# EAGLE design Shield (EAGLE 6.6.0)
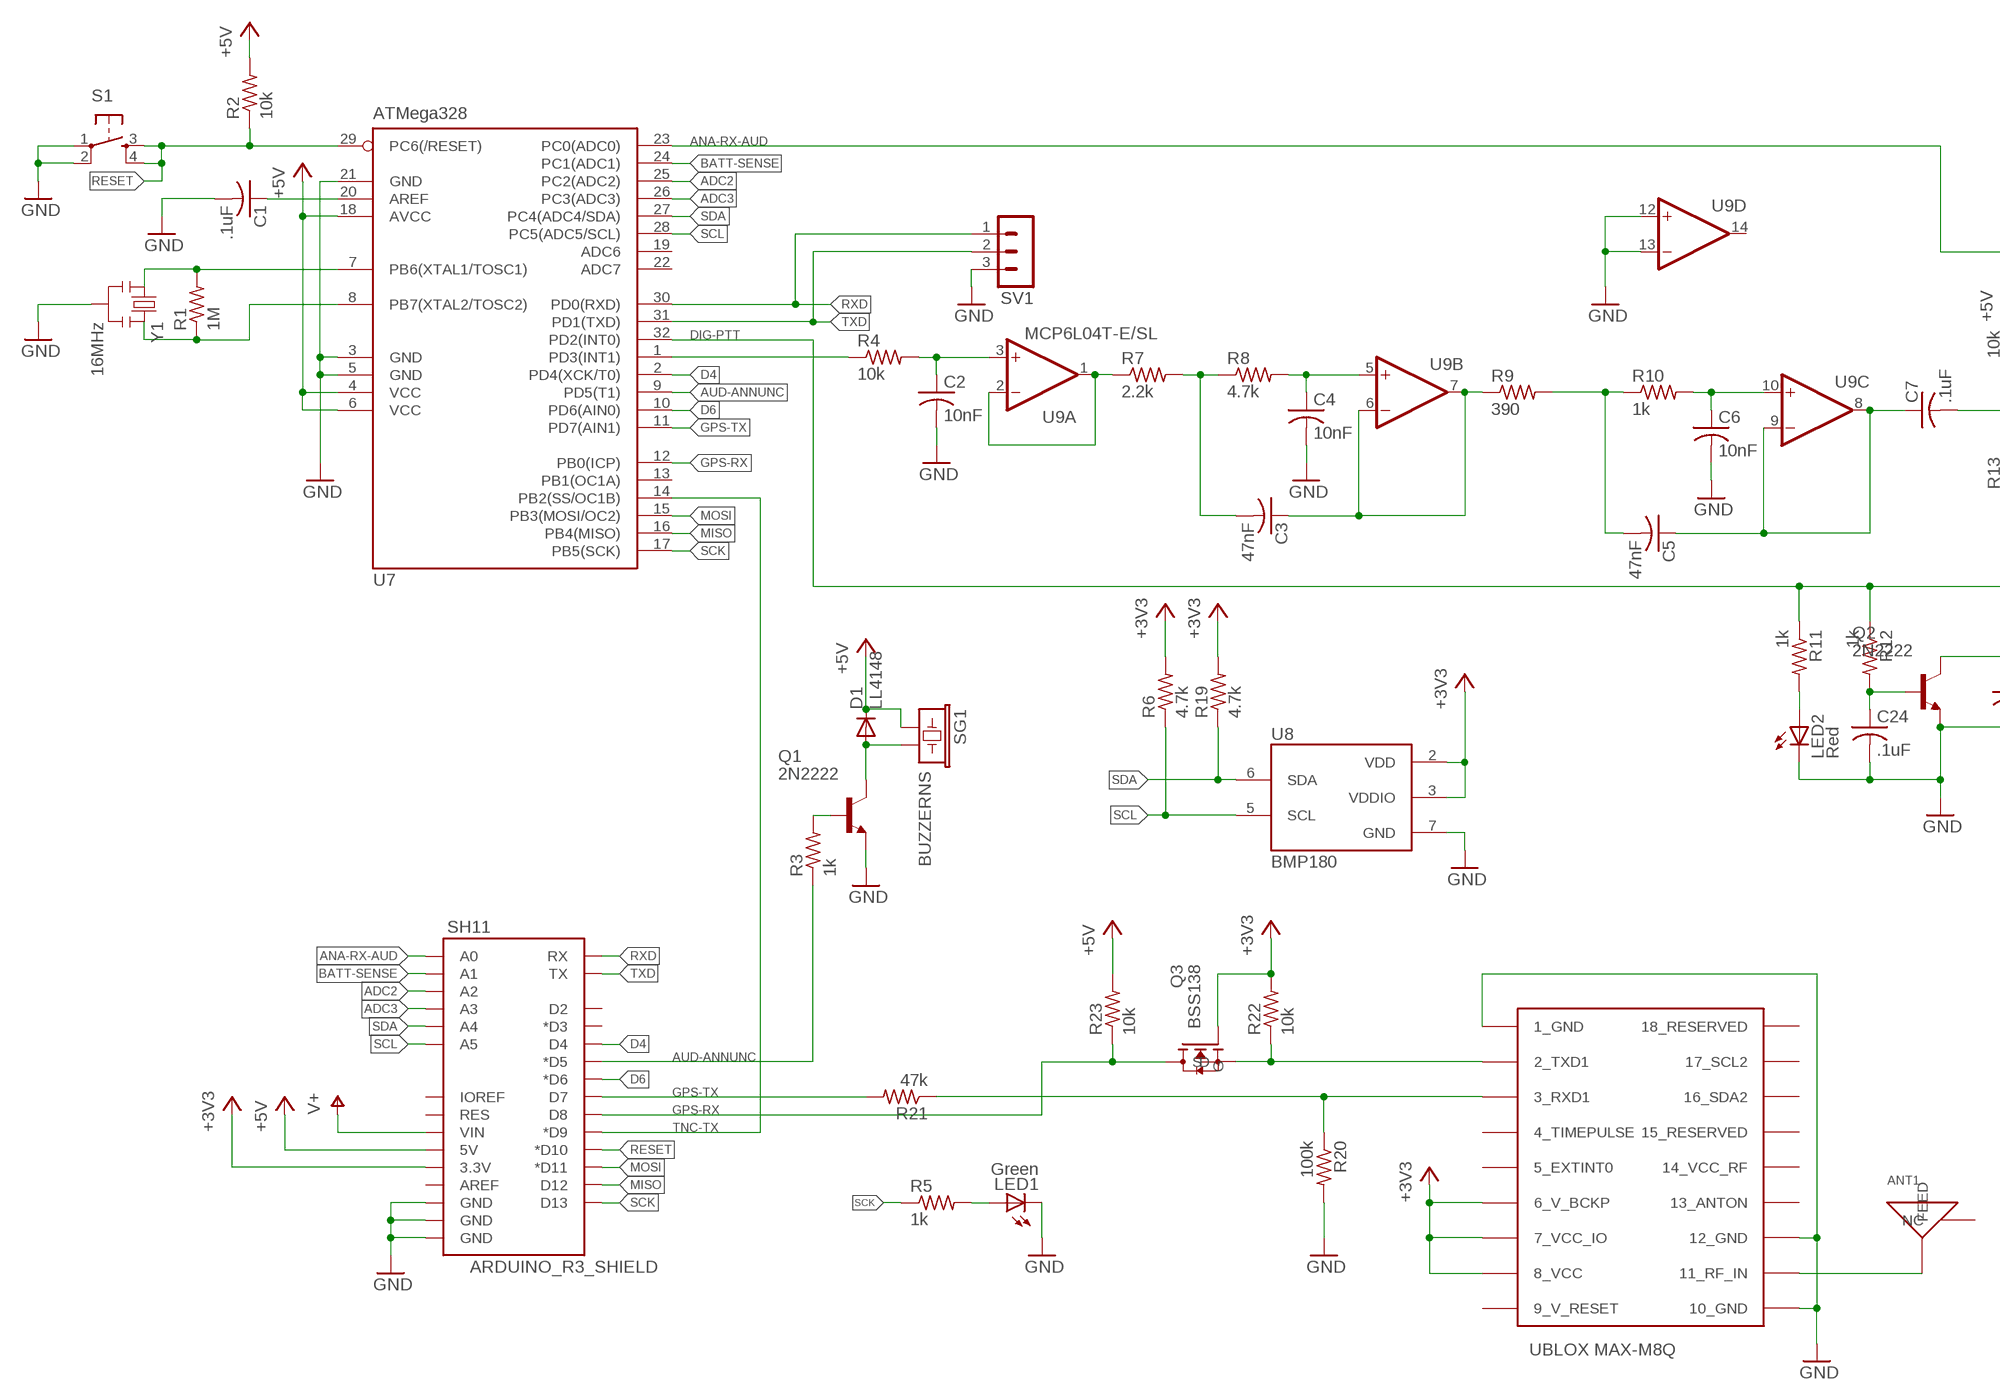
[diagram p0: schematic, sheet 1, part 1 of 2]
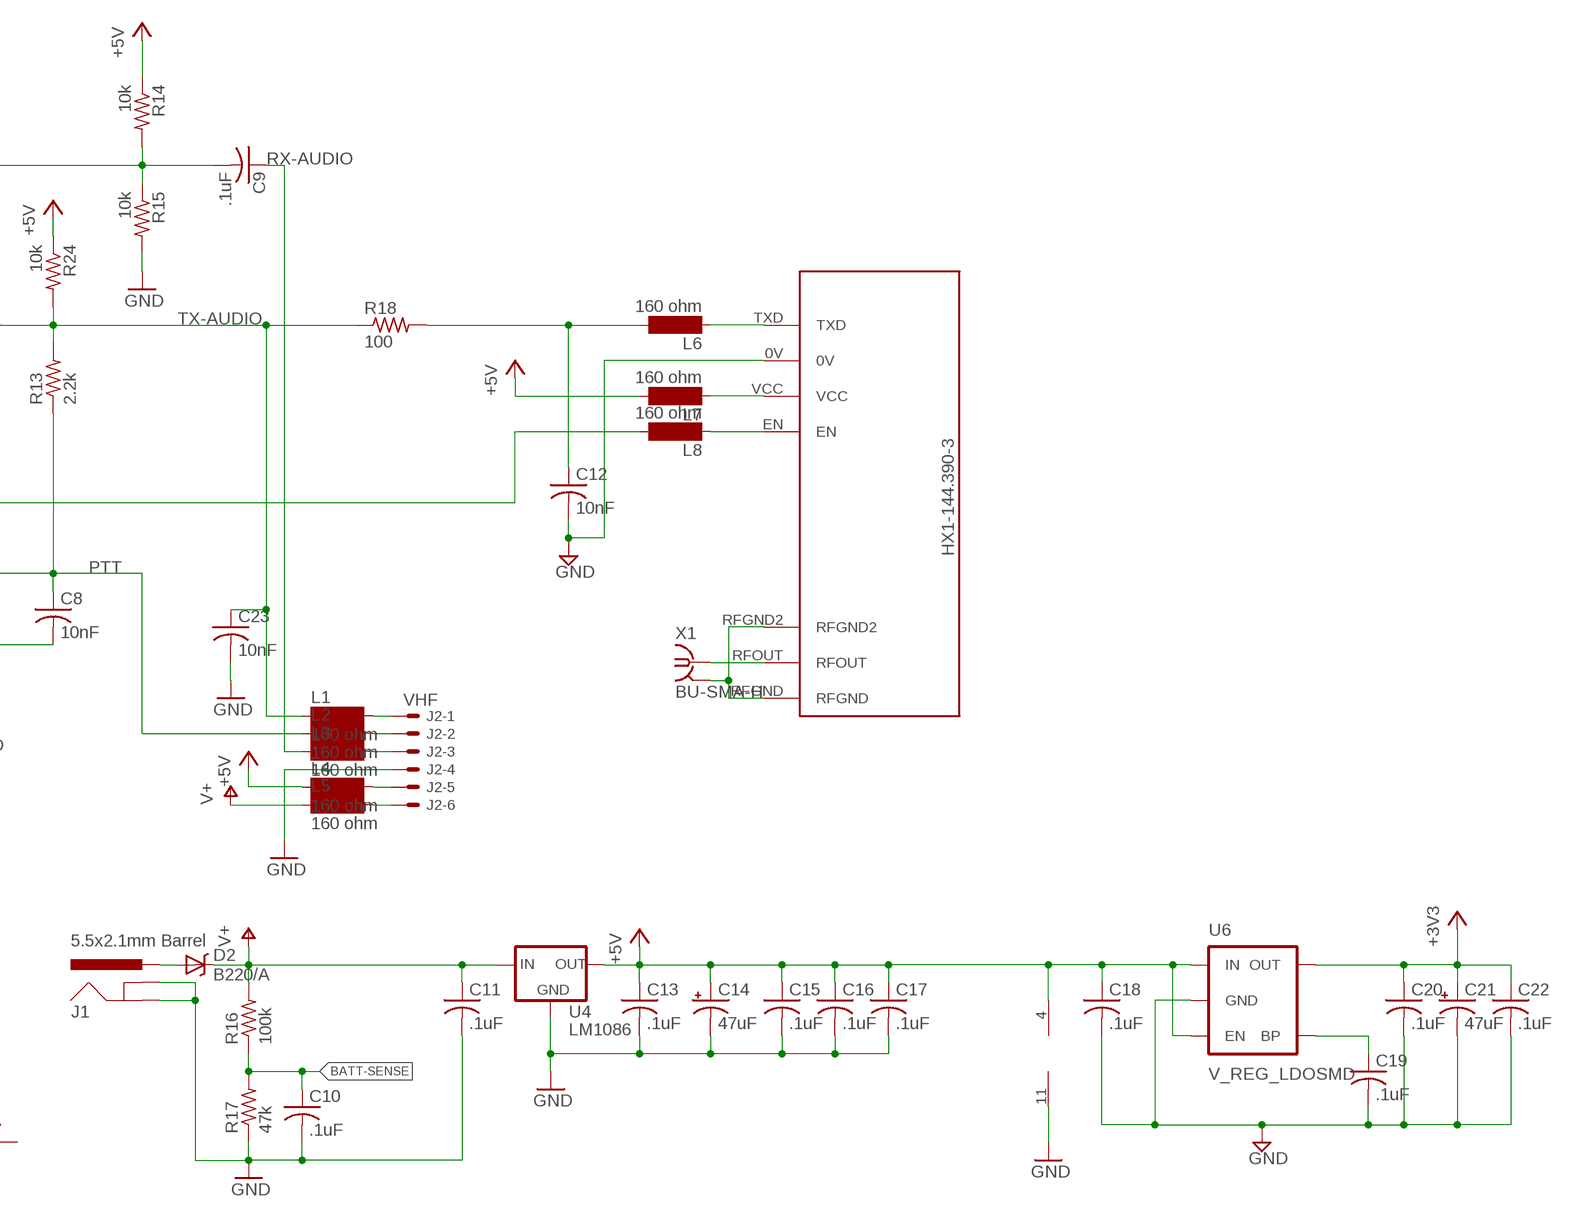
[diagram p1: schematic, sheet 1, part 2 of 2]

## Parts
ANT1  GPS_ANT_SMDBAR  [1575AT43A40]
C1  .1uF  C-USC0805  [C0805]
C2  10nF  C-USC0805  [C0805]
C3  47nF  C-USC0805  [C0805]
C4  10nF  C-USC0805  [C0805]
C5  47nF  C-USC0805  [C0805]
C6  10nF  C-USC0805  [C0805]
C7  .1uF  C-USC0805  [C0805]
C8  10nF  C-USC0805  [C0805]
C9  .1uF  C-USC0805  [C0805]
C10  .1uF  C-USC0805  [C0805]
C11  .1uF  C-USC0805  [C0805]
C12  10nF  C-USC0805  [C0805]
C13  .1uF  C-USC0805  [C0805]
C14  47uF  CPOL-US153CLV-0605  [153CLV-0605]
C15  .1uF  C-USC0805  [C0805]
C16  .1uF  C-USC0805  [C0805]
C17  .1uF  C-USC0805  [C0805]
C18  .1uF  C-USC0805  [C0805]
C19  .1uF  C-USC0805  [C0805]
C20  .1uF  C-USC0805  [C0805]
C21  47uF  CPOL-US153CLV-0605  [153CLV-0605]
C22  .1uF  C-USC0805  [C0805]
C23  10nF  C-USC0805  [C0805]
C24  .1uF  C-USC0805  [C0805]
D1  LL4148  DIODE-MINIMELF  [MINIMELF]
D2  B220/A  B340A  [SMA-DIODE]
J1  5.5x2.1mm Barrel  POWER_JACKSMD  [POWER_JACK_SMD]
J2  VHF  22-05-7068-06  [7395-06]
L1  160 ohm  SM-1206  [SM-1206]
L2  160 ohm  SM-1206  [SM-1206]
L3  160 ohm  SM-1206  [SM-1206]
L4  160 ohm  SM-1206  [SM-1206]
L5  160 ohm  SM-1206  [SM-1206]
L6  160 ohm  SM-1206  [SM-1206]
L7  160 ohm  SM-1206  [SM-1206]
L8  160 ohm  SM-1206  [SM-1206]
LED1  Green  LEDCHIPLED_1206  [CHIPLED_1206]
LED2  Red  LEDCHIPLED_1206  [CHIPLED_1206]
Q1  2N2222  BC817-16LT1SMD  [SOT23-BEC]
Q2  2N2222  BC817-16LT1SMD  [SOT23-BEC]
Q3  BSS138  [BSS138]
R1  1M  R-US_R0805  [R0805]
R2  10k  R-US_R0805  [R0805]
R3  1k  R-US_R0805  [R0805]
R4  10k  R-US_R0805  [R0805]
R5  1k  R-US_R0805  [R0805]
R6  4.7k  R-US_R0805  [R0805]
R7  2.2k  R-US_R0805  [R0805]
R8  4.7k  R-US_R0805  [R0805]
R9  390  R-US_R0805  [R0805]
R10  1k  R-US_R0805  [R0805]
R11  1k  R-US_R0805  [R0805]
R12  1k  R-US_R0805  [R0805]
R13  2.2k  R-US_R0805  [R0805]
R14  10k  R-US_R0805  [R0805]
R15  10k  R-US_R0805  [R0805]
R16  100k  R-US_R0805  [R0805]
R17  47k  R-US_R0805  [R0805]
R18  100  R-US_R0805  [R0805]
R19  4.7k  R-US_R0805  [R0805]
R20  100k  R-US_R0805  [R0805]
R21  47k  R-US_R0805  [R0805]
R22  10k  R-US_R0805  [R0805]
R23  10k  R-US_R0805  [R0805]
R24  10k  R-US_R0805  [R0805]
S1  TAC_SWITCHSMD  [TACTILE_SWITCH_SMD]
SG1  BUZZERNS  [BUZZER-12MM-NS]
SH11  ARDUINO_R3_SHIELD  [UNO_R3_SHIELD]
SV1  MA03-1  [MA03-1]
U3  UBLOX_MAX  [UBLOX_MAX]
U4  LM1086  LM1086TO263  [TO263]
U5  RADIOMETRIX-HX1  [RADIOMETRIX-HX1]
U6  V_REG_LDOSMD  [SOT23-5]
U7  ATMega328  MEGA8-AI  [TQFP32-08]
U8  BMP180  [BMP180]
U9  LMV324M  [SO14]
X1  BU-SMA-H  [BU-SMA-H]
Y1  16MHz  RESONATOR16MHZ  [RESONATOR-SMD]

## Nets
+3V3: C20.1 C21.+ C22.1 Q3.G R6.2 R19.2 R22.2 SH11.3.3V U3.6_V_BCKP U3.7_VCC_IO U3.8_VCC U6.5(OUT) U8.2(VDD) U8.3(VDDIO)
+5V [Power]: C13.1 C14.+ C15.1 C16.1 C17.1 C18.1 D1.C L4.1 L7.2 R2.2 R14.1 R23.2 R24.1 SG1.+ SH11.5V U4.2(OUT) U6.1(IN) U6.3(EN) U7.4(VCC) U7.6(VCC) U7.18(AVCC) U9.4(P:V+)
ADC2: SH11.A2 U7.25(PC2(ADC2))
ADC3: SH11.A3 U7.26(PC3(ADC3))
ANA-RX-AUD: C9.2 R14.2 R15.1 SH11.A0 U7.23(PC0(ADC0))
AUD-ANNUNC: R3.1 SH11.D5(*D5) U7.9(PD5(T1))
BATT-SENSE: C10.1 R16.1 R17.2 SH11.A1 U7.24(PC1(ADC1))
D4: SH11.D4 U7.2(PD4(XCK/T0))
D6: SH11.D6(*D6) U7.10(PD6(AIN0))
DIG-PTT: L8.2 R11.1 R12.1 U7.32(PD2(INT0))
GND [Power]: C1.2 C2.2 C4.2 C6.2 C8.2 C10.2 C11.2 C12.2 C13.2 C14.- C15.2 C16.2 C17.2 C18.2 C19.2 C20.2 C21.- C22.2 C23.2 C24.2 J1.GND(GNDBREAK) J1.P$4(GND) J2.4 LED1.C LED2.C Q1.E Q2.E R15.2 R17.1 R20.2 S1.1 S1.2 SH11.GND@0(GND) SH11.GND@1(GND) SH11.GND@2(GND) SV1.3 U3.1_GND U3.10_GND U3.12_GND U4.1(GND) U5.0V U6.2(GND) U7.3(GND) U7.5(GND) U7.21(GND) U8.7(GND) U9.11(P:V-) U9.12(D:+IN) U9.13(D:-IN) Y1.2
GPS-RX: Q3.D R23.1 SH11.D8 U7.12(PB0(ICP))
GPS-TX: R21.2 SH11.D7 U7.11(PD7(AIN1))
MISO: SH11.D12 U7.16(PB4(MISO))
MOSI: SH11.D11(*D11) U7.15(PB3(MOSI/OC2))
N$1: C2.1 R4.2 U9.3(A:+IN)
N$2: R7.1 U9.1(A:OUT) U9.2(A:-IN)
N$3: C3.2 R7.2 R8.1
N$4: C4.1 R8.2 U9.5(B:+IN)
N$5: C3.1 R9.1 U9.6(B:-IN) U9.7(B:OUT)
N$6: C5.2 R9.2 R10.1
N$7: C6.1 R10.2 U9.10(C:+IN)
N$8: D2.A J1.VIN0(PWR)
N$9: D1.A Q1.C SG1.-
N$10: C12.1 L6.2 R18.2
N$11: C5.1 C7.1 U9.8(C:OUT) U9.9(C:-IN)
N$12: U5.RFOUT X1.1
N$13: R4.1 U7.1(PD3(INT1))
N$14: Q3.S R22.1 U3.2_TXD1
N$15: R20.1 R21.1 U3.3_RXD1
N$16: ANT1.FEED U3.11_RF_IN
N$17: R1.1 U7.8(PB7(XTAL2/TOSC2)) Y1.3
N$20: C24.1 Q2.B R12.2
N$23: LED2.A R11.2
N$25: LED1.A R5.2
N$27: Q1.B R3.2
N$41: L6.1 U5.TXD
N$42: L7.1 U5.VCC
N$43: L8.1 U5.EN
N$45: J2.1 L1.2
N$46: J2.2 L2.2
N$47: J2.3 L3.2
N$49: J2.5 L4.2
N$50: J2.6 L5.2
N$59: C1.1 U7.20(AREF)
N$60: C19.1 U6.4(BP)
N$64: R1.2 U7.7(PB6(XTAL1/TOSC1)) Y1.1
PTT: C8.1 L2.1 Q2.C R13.1
RESET: R2.1 S1.3 S1.4 SH11.D10(*D10) U7.29(PC6(/RESET))
RFGND [Power]: U5.RFGND U5.RFGND2 X1.2 X1.3 X1.4 X1.5
RX-AUDIO: C9.1 L3.1
RXD: SH11.RX SV1.1 U7.30(PD0(RXD))
SCK: R5.1 SH11.D13 U7.17(PB5(SCK))
SCL: R6.1 SH11.A5 U7.28(PC5(ADC5/SCL)) U8.5(SCL)
SDA: R19.1 SH11.A4 U7.27(PC4(ADC4/SDA)) U8.6(SDA)
TNC-TX: SH11.D9(*D9) U7.14(PB2(SS/OC1B))
TX-AUDIO: C7.2 C23.1 L1.1 R13.2 R18.1 R24.2
TXD: SH11.TX SV1.2 U7.31(PD1(TXD))
V+ [Power]: C11.1 D2.C L5.1 R16.2 SH11.VIN U4.3(IN)
Unconnected: ANT1.NC SH11.AREF SH11.D2 SH11.D3(*D3) SH11.IOREF SH11.RES U3.4_TIMEPULSE U3.5_EXTINT0 U3.13_ANTON U3.14_VCC_RF U3.15_RESERVED U3.16_SDA2 U3.17_SCL2 U3.18_RESERVED U7.13(PB1(OC1A)) U7.19(ADC6) U7.22(ADC7) U9.14(D:OUT)

## Power pins joined to a net without a drawn wire
9_V_RESET: U3.9_V_RESET

## Library data of the parts
ANT1 = Parts:GPS_ANT_SMDBAR: 1.575 GHz GPS Antenna Johanson Technology http://www.digikey.com/product-detail/en/1575AT43A0040E/712-1003-1-ND/1560832; DIGIKEY: 712-1003-1-ND
C1 C7 C9-C11 C13 C15-C20 C22 C24 = resistor:C-US: CAPACITOR, American symbol; DIGIKEY: 311-1361-1-ND
C2 C4 C6 C8 C12 C23 = resistor:C-US: CAPACITOR, American symbol; DIGIKEY: 399-1158-1-ND
C3 C5 = resistor:C-US: CAPACITOR, American symbol; DIGIKEY: 399-1166-1-ND
C14 C21 = resistor:CPOL-US: POLARIZED CAPACITOR, American symbol; DIGIKEY: PCE3842CT-ND
D1 = diode:DIODE-: DIODE; DIGIKEY: 568-1749-1-ND
D2 = SparkFun-DiscreteSemi:B340A: Schottky Diode 3A-40V; DIGIKEY: 641-1258-1-ND; PROD_ID: DIO-09886; VALUE: BA340A
J1 = SparkFun-Connectors:POWER_JACK: Power Jack This is the standard 5.5mm barrel jack for power. The PTH is the most common, proven, reliable, footprint. The Slot footprint only works if the mill layer is transmitted to the PCB fab house so be warned. Mating wall wart : TOL-00298 (and others); DIGIKEY: CP-002AHPJCT-ND; PROD_ID: CONN-08106
J2 = con-molex:22-?-06: CONNECTOR wire to board 2.54 mm (.1 inch) pitch header; DIGIKEY: WM4304-ND; OC_FARNELL: unknown; OC_NEWARK: unknown
L1-L8 = inductor-neosid:SM-1206: INDUCTOR SMD chip inductor; DIGIKEY: 240-2411-1-ND; OC_FARNELL: unknown; OC_NEWARK: unknown
LED1 = led:LED: LED OSRAM: - CHIPLED LG R971, LG N971, LY N971, LG Q971, LY Q971, LO R971, LY R971 LH N974, LH R974 LS Q976, LO Q976, LY Q976 LO Q996 - Hyper CHIPLED LW Q18S LB Q993, LB Q99A, LB R99A - SideLED LS A670, LO A670, LY A670, LG A670, LP A670 LB A673, LV A673, LT A673, LW A673 LH A674 LY A675 LS A676, LA A676, LO A676, LY A676, LW A676 LS A679, LY A679, LG A679 - Hyper Micro SIDELED® LS Y876, LA Y876, LO Y876, LY Y876 LT Y87S - SmartLED LW L88C, LW L88S LB L89C, LB L89S, LG L890 LS L89K, LO L89K, LY L89K LS L896, LA L896, LO L896, LY L896 - TOPLED LS T670, LO T670, LY T670, LG T670, LP T670 LSG T670, LSP T670, LSY T670, LOP T670, LYG T670 LG T671, LOG T671, LSG T671 LB T673, LV T673, LT T673, LW T673 LH T674 LS T676, LA T676, LO T676, LY T676, LB T676, LH T676, LSB T676, LW T676 LB T67C, LV T67C, LT T67C, LS T67K, LO T67K, LY T67K, LW E67C LS E67B, LA E67B, LO E67B, LY E67B, LB E67C, LV E67C, LT E67C LW T67C LS T679, LY T679, LG T679 LS T770, LO T770, LY T770, LG T770, LP T770 LB T773, LV T773, LT T773, LW T773 LH T774 LS E675, LA E675, LY E675, LS T675 LS T776, LA T776, LO T776, LY T776, LB T776 LHGB T686 LT T68C, LB T68C - Hyper Mini TOPLED® LB M676 - Mini TOPLED Santana® LG M470 LS M47K, LO M47K, LY M47K Source: http://www.osram.convergy.de LUXEON: - LUMILED® LXK2-PW12-R00, LXK2-PW12-S00, LXK2-PW14-U00, LXK2-PW14-V00 LXK2-PM12-R00, LXK2-PM12-S00, LXK2-PM14-U00 LXK2-PE12-Q00, LXK2-PE12-R00, LXK2-PE12-S00, LXK2-PE14-T00, LXK2-PE14-U00 LXK2-PB12-K00, LXK2-PB12-L00, LXK2-PB12-M00, LXK2-PB14-N00, LXK2-PB14-P00, LXK2-PB14-Q00 LXK2-PR12-L00, LXK2-PR12-M00, LXK2-PR14-Q00, LXK2-PR14-R00 LXK2-PD12-Q00, LXK2-PD12-R00, LXK2-PD12-S00 LXK2-PH12-R00, LXK2-PH12-S00 LXK2-PL12-P00, LXK2-PL12-Q00, LXK2-PL12-R00 Source: www.luxeon.com KINGBRIGHT: KA-3528ASYC Source: www.kingbright.com; DIGIKEY: 160-1169-1-ND
LED2 = led:LED: LED OSRAM: - CHIPLED LG R971, LG N971, LY N971, LG Q971, LY Q971, LO R971, LY R971 LH N974, LH R974 LS Q976, LO Q976, LY Q976 LO Q996 - Hyper CHIPLED LW Q18S LB Q993, LB Q99A, LB R99A - SideLED LS A670, LO A670, LY A670, LG A670, LP A670 LB A673, LV A673, LT A673, LW A673 LH A674 LY A675 LS A676, LA A676, LO A676, LY A676, LW A676 LS A679, LY A679, LG A679 - Hyper Micro SIDELED® LS Y876, LA Y876, LO Y876, LY Y876 LT Y87S - SmartLED LW L88C, LW L88S LB L89C, LB L89S, LG L890 LS L89K, LO L89K, LY L89K LS L896, LA L896, LO L896, LY L896 - TOPLED LS T670, LO T670, LY T670, LG T670, LP T670 LSG T670, LSP T670, LSY T670, LOP T670, LYG T670 LG T671, LOG T671, LSG T671 LB T673, LV T673, LT T673, LW T673 LH T674 LS T676, LA T676, LO T676, LY T676, LB T676, LH T676, LSB T676, LW T676 LB T67C, LV T67C, LT T67C, LS T67K, LO T67K, LY T67K, LW E67C LS E67B, LA E67B, LO E67B, LY E67B, LB E67C, LV E67C, LT E67C LW T67C LS T679, LY T679, LG T679 LS T770, LO T770, LY T770, LG T770, LP T770 LB T773, LV T773, LT T773, LW T773 LH T774 LS E675, LA E675, LY E675, LS T675 LS T776, LA T776, LO T776, LY T776, LB T776 LHGB T686 LT T68C, LB T68C - Hyper Mini TOPLED® LB M676 - Mini TOPLED Santana® LG M470 LS M47K, LO M47K, LY M47K Source: http://www.osram.convergy.de LUXEON: - LUMILED® LXK2-PW12-R00, LXK2-PW12-S00, LXK2-PW14-U00, LXK2-PW14-V00 LXK2-PM12-R00, LXK2-PM12-S00, LXK2-PM14-U00 LXK2-PE12-Q00, LXK2-PE12-R00, LXK2-PE12-S00, LXK2-PE14-T00, LXK2-PE14-U00 LXK2-PB12-K00, LXK2-PB12-L00, LXK2-PB12-M00, LXK2-PB14-N00, LXK2-PB14-P00, LXK2-PB14-Q00 LXK2-PR12-L00, LXK2-PR12-M00, LXK2-PR14-Q00, LXK2-PR14-R00 LXK2-PD12-Q00, LXK2-PD12-R00, LXK2-PD12-S00 LXK2-PH12-R00, LXK2-PH12-S00 LXK2-PL12-P00, LXK2-PL12-Q00, LXK2-PL12-R00 Source: www.luxeon.com KINGBRIGHT: KA-3528ASYC Source: www.kingbright.com; DIGIKEY: 160-1405-1-ND
Q1 Q2 = transistor-npn:BC817*: NPN Transistor; DIGIKEY: MMBT2222AFSCT-ND
Q3 = Ava:BSS138: BSS138 N-Channel Logic Level Enhancement Mode Field Effect Transistor; DIGIKEY: BSS138CT-ND
R1 = resistor:R-US_: RESISTOR, American symbol; DIGIKEY: 311-1.0MARCT-ND
R2 R4 R14 R15 R22-R24 = resistor:R-US_: RESISTOR, American symbol; DIGIKEY: 311-10.0KCRCT-ND
R3 R5 R10-R12 = resistor:R-US_: RESISTOR, American symbol; DIGIKEY: 311-1.0KARCT-ND
R6 R8 R19 = resistor:R-US_: RESISTOR, American symbol; DIGIKEY: 311-4.7KARCT-ND
R7 R13 = resistor:R-US_: RESISTOR, American symbol; DIGIKEY: 311-2.2KARCT-ND
R9 = resistor:R-US_: RESISTOR, American symbol; DIGIKEY: 311-390ARCT-ND
R16 R20 = resistor:R-US_: RESISTOR, American symbol; DIGIKEY: 311-100KCRCT-ND
R17 R21 = resistor:R-US_: RESISTOR, American symbol; DIGIKEY: 311-47.0KCRCT-ND
R18 = resistor:R-US_: RESISTOR, American symbol; DIGIKEY: 311-100ARCT-ND
S1 = SparkFun-Electromechanical:TAC_SWITCH: Momentary Switch Button commonly used for reset or general input. Spark Fun Electronics SKU : COM-00097 SMT- SWCH-08247; DIGIKEY: CKN9104CT-ND; PROD_ID: SWCH-08247
SG1 = SparkFun-Electromechanical:BUZZER: Buzzer 12mm Spark Fun Electronics SKU : Comp-Buzzer; DIGIKEY: 102-1155-ND
SH11 = sparkfun-boards:ARDUINO_R3_SHIELD: Shield form compatible with the Arduino Uno R3.; SPARKFUN: PRT-10007
SV1 = con-lstb:MA03-1: PIN HEADER; DIGIKEY: 952-2264-ND; OC_FARNELL: unknown; OC_NEWARK: unknown
U3 = Ava:UBLOX_MAX: UBLOX MAX; ALT-PART: UBLOX MAX-M8Q
U4 = v-reg-2:LM1086; DIGIKEY: LM1086ISX-5.0/NOPBCT-ND
U5 = Ava:RADIOMETRIX-HX1; ALT-PART: HX1-144.390-3
U6 = SparkFun-PowerIC:V_REG_LDO: Voltage Regulator LDO Standard 150mA LDO voltage regulator in SOT-23 layout. Micrel part MIC5205. BP (by-pass) pin is used to lower output noise with 470pF cap.; DIGIKEY: LP3985IM5-3.3/NOPBCT-ND
U7 = atmel:MEGA8: MICROCONTROLLER 8 Kbytes FLASH, 1 kbytes SRAM, 512 bytes EEPROM, USART, 6-channel 10 bit ADC, 2-channel 8 bit ADC Pin compatible with Atmega48, ATMega88, ATMega168 Source: avr.lbr; DIGIKEY: ATMEGA328P-15AZCT-ND; MPN: ATMEGA8-16AU; OC_FARNELL: 9171371; OC_NEWARK: 73M8863
U8 = SparkFun-Sensors:BMP180: BOSCH BMP180 DIGITAL BAROMETRIC PRESSURE SENSOR Web page: http://www.bosch-sensortec.com/en/homepage/products_3/environmental_sensors_1/bmp180_1/bmp180 Datasheet: http://ae-bst.resource.bosch.com/media/products/dokumente/bmp180/BST-BMP180-DS000-09.pdf The BMP180 is the function compatible successor of the BMP085, a new generation of high precision digital pressure sensors for consumer applications. The ultra-low power, low voltage electronics of the BMP180 is optimized for use in mobile phones, PDAs, GPS navigation devices and outdoor equipment. With a low altitude noise of merely 0.25m at fast conversion time, the BMP180 offers superior performance. The I2C interface allows for easy system integration with a microcontroller. The BMP180 is based on piezo-resistive technology for EMC robustness, high accuracy and linearity as well as long term stability. Key features: - Temperature measurement included - I2C interface - Fully calibrated - Pb-free, halogen-free and RoHS compliant, - MSL 1 Basic specs: Pressure range: 300 to 1100hPa (+9000m to -500m relating to sea level) Supply voltage: 1.8 to 3.6V (VDD), 1.62V to 3.6V (VDDIO) Package: LGA package with metal lid Small footprint: 3.6mm x 3.8mm Super-flat: 0.93mm height Low power: 5μA at 1 sample / sec. in standard mode Low noise: 0.06hPa (0.5m) in ultra low power mode, 0.02hPa (0.17m) advanced resolution mode Typical applications: - Enhancement of GPS navigation (dead-reckoning, slope detection, etc.) - In- and out-door navigation - Leisure and sports - Weather forecast - Vertical velocity indication (rise/sink speed); SPARKFUN: COM-11823
U9 = linear:LMV324?*: Quad General Purpose, Low Voltage, Rail-to-Rail Output Operational Amplifiers Source: http://www.national.com/mpf/LM/LMV321.html http://www.national.com/dt/lmv_qual.pdf; ALT-PART: MCP6L04T-E/SL; DIGIKEY: MCP6L04T-E/SLCT-ND
X1 = con-coax:BU-SMA-H: FEMALE SMA CONNECTOR Radiall; DIGIKEY: CONSMA001-ND; OC_FARNELL: unknown; OC_NEWARK: unknown
Y1 = SparkFun-FreqCtrl:RESONATOR: Resonator Small SMD resonator. Used, eg, on the Arduino Pro/ Pro Mini boards. 8MHz- XTAL-08895 16MHz- XTAL-08900; DIGIKEY: 478-5420-1-ND; PROD_ID: XTAL-08900

## Net classes
1 Power: width 0.127 mm, clearance 0.025 mm

## Board
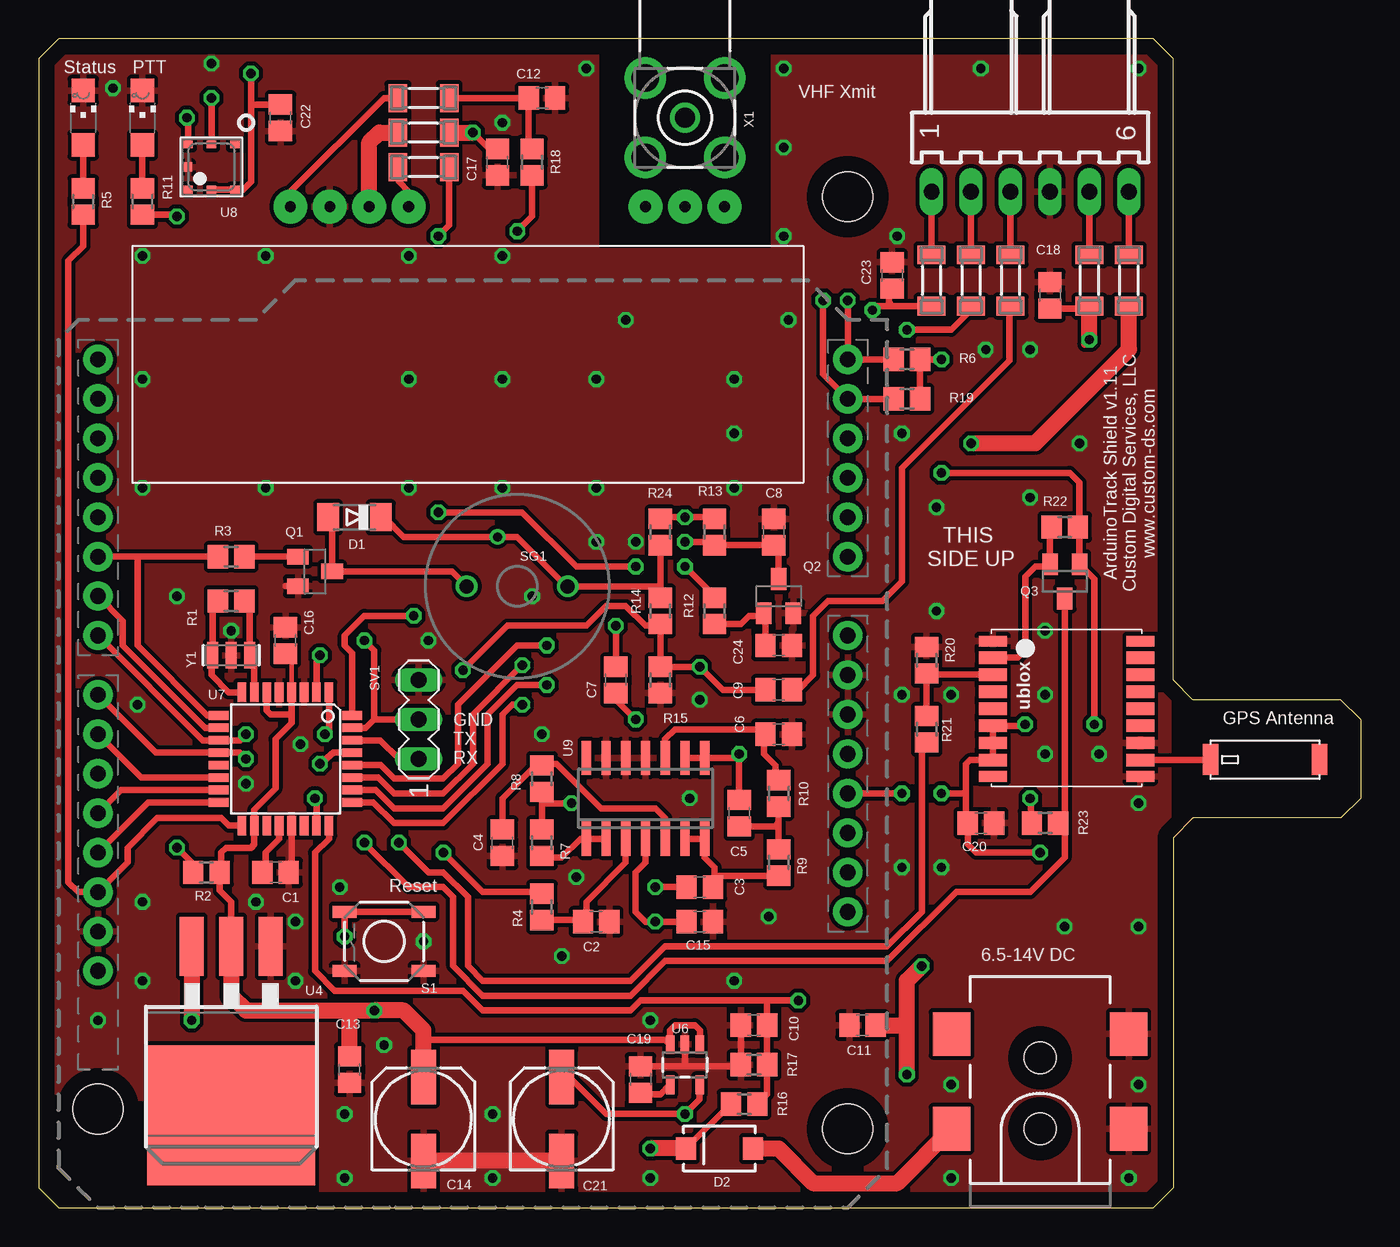
[diagram p2: board, top side]
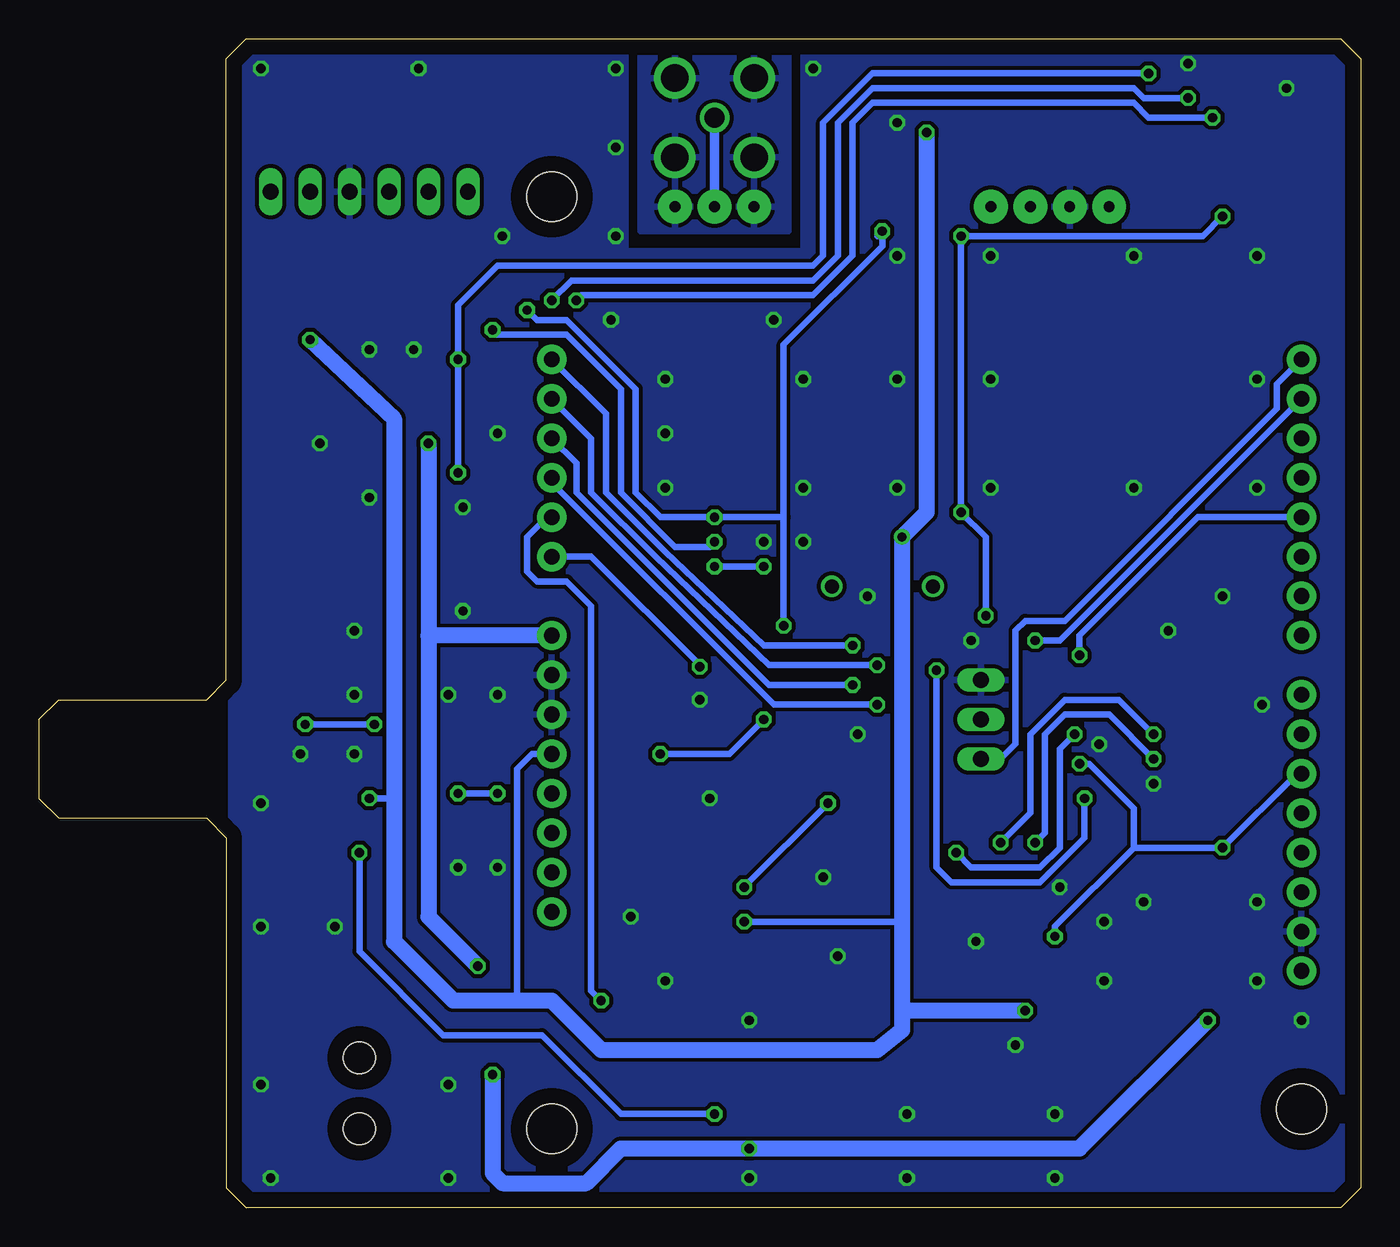
[diagram p3: board, bottom side, seen from below]

Size 85.09 x 75.25 mm. Coordinates in mm from the lower left corner, seen from the top.
Outline: 85.09,31.43 85.09,26.35 83.82,25.08 74.3,25.08 73.03,23.81 73.03,1.27 71.75,0 1.27,0 0,1.27 0,73.98 1.27,75.25 71.75,75.25 73.03,73.98 73.03,33.97 74.3,32.7 83.82,32.7 85.09,31.43
Copper layers (1*16): Top 0.035mm / dielectric 1.5mm / Bottom 0.035mm
Design rules "default *": minimum track width 10mil, minimum drill 23mil, track to track 10mil, track to pad 10mil, pad to pad 8mil, via to via 10mil, smd to smd 8mil, copper to edge 40mil, drill to drill 8mil, minimum pad ring 10mil, minimum via ring 8mil, stop-mask expansion 4mil, vias tented up to drill 0mil, thermal gap 10mil
Holes 3.2 mm at 3.81,6.35 52.07,5.08 52.07,65.09

### Footprints (pad centres in the part's own frame; a part is rotated, then mirrored left to right if it is on the bottom)
1575AT43A40 = smd 1 x 2: FEED 0.5,-1; NC 7.5,-1
C0805 = smd 1.3 x 1.5: 1 -0.85,0; 2 0.85,0
153CLV-0605 = smd 3.5 x 1.6: + 2.7,0; - -2.7,0
MINIMELF = smd 1.4 x 1.8: A 1.7,0; C -1.7,0
SMA-DIODE = smd 1.27 x 1.47: A -2.15,0; C 2.15,0
POWER_JACK_SMD = smd 2.8 x 2.4: GND 0,-5.7; P$4 6.1,-5.7; VIN0 0,5.7; VIN1 6.1,5.7 | hole 2.032: 0,0; 4.572,0
7395-06 = drill 1.016 long: 1 6.35,0; 2 3.81,0; 3 1.27,0; 4 -1.27,0; 5 -3.81,0; 6 -6.35,0
SM-1206 = smd 1.2 x 1.8: 1 -1.65,0; 2 1.65,0
CHIPLED_1206 = smd 1.5 x 1.5: A 0,-1.75; C 0,1.75
SOT23-BEC = smd 1 x 1.4: B -0.95,-1.1; C 0,1.1; E 0.95,-1.1
BSS138 = smd 1 x 1.4: D 0,1.1; G -0.95,-1.1; S 0.95,-1.1
R0805 = smd 1.3 x 1.5: 1 -0.85,0; 2 0.85,0
TACTILE_SWITCH_SMD = smd 1.524 x 0.762: 1 -2.54,1.905; 2 2.54,1.905; 3 -2.54,-1.905; 4 2.54,-1.905
BUZZER-12MM-NS = drill 0.9: + 3.25,0; - -3.25,0
UNO_R3_SHIELD = drill 1.016 pad 1.88: 3.3V 50.8,26.67; 5V 50.8,29.21; A0 50.8,41.91; A1 50.8,44.45; A2 50.8,46.99; A3 50.8,49.53; A4 50.8,52.07; A5 50.8,54.61; AREF 2.54,15.24; D2 2.54,49.53; D3 2.54,46.99; D4 2.54,44.45; D5 2.54,41.91; D6 2.54,39.37; D7 2.54,36.83; D8 2.54,33.02; D9 2.54,30.48; D10 2.54,27.94; D11 2.54,25.4; D12 2.54,22.86; D13 2.54,20.32; GND@0 50.8,31.75; GND@1 50.8,34.29; GND@2 2.54,17.78; IOREF 50.8,21.59; NC 50.8,19.05; RES 50.8,24.13; RX 2.54,54.61; TX 2.54,52.07; VIN 50.8,36.83
MA03-1 = drill 1.016 long: 1 -2.54,0; 2 0,0; 3 2.54,0
UBLOX_MAX = smd 1.8 x 0.7: 1_GND 4.95,-4.4; 9_V_RESET 4.95,4.3; 10_GND -4.55,4.3; 18_RESERVED -4.55,-4.4 | smd 1.8 x 0.8: 2_TXD1 4.95,-3.35; 3_RXD1 4.95,-2.25; 4_TIMEPULSE 4.95,-1.15; 5_EXTINT0 4.95,-0.05; 6_V_BCKP 4.95,1.05; 7_VCC_IO 4.95,2.15; 8_VCC 4.95,3.25; 11_RF_IN -4.55,3.25; 12_GND -4.55,2.15; 13_ANTON -4.55,1.05; 14_VCC_RF -4.55,-0.05; 15_RESERVED -4.55,-1.15; 16_SDA2 -4.55,-2.25; 17_SCL2 -4.55,-3.35
TO263 = smd 1.524 x 3.81: 1 -2.54,-8.255; 2 0,-8.255; 3 2.54,-8.255 | smd 10.8 x 9: 4 0,2.635
RADIOMETRIX-HX1 = drill 0.7 pad 2.184: 0V 8.89,-10.16; EN 3.81,-10.16; RFGND -11.43,-10.16; RFGND2 -16.51,-10.16; RFOUT -13.97,-10.16; TXD 11.43,-10.16; VCC 6.35,-10.16
SOT23-5 = smd 0.55 x 1.2: 1 -0.95,-1.3; 2 0,-1.3; 3 0.95,-1.3; 4 0.95,1.3; 5 -0.95,1.3
TQFP32-08 = smd 1.27 x 0.559: 1 -4.293,2.8; 2 -4.293,2; 3 -4.293,1.2; 4 -4.293,0.4; 5 -4.293,-0.4; 6 -4.293,-1.2; 7 -4.293,-2; 8 -4.293,-2.8; 17 4.293,-2.8; 18 4.293,-2; 19 4.293,-1.2; 20 4.293,-0.4; 21 4.293,0.4; 22 4.293,1.2; 23 4.293,2; 24 4.293,2.8 | smd 0.559 x 1.27: 9 -2.8,-4.293; 10 -2,-4.293; 11 -1.2,-4.293; 12 -0.4,-4.293; 13 0.4,-4.293; 14 1.2,-4.293; 15 2,-4.293; 16 2.8,-4.293; 25 2.8,4.293; 26 2,4.293; 27 1.2,4.293; 28 0.4,4.293; 29 -0.4,4.293; 30 -1.2,4.293; 31 -2,4.293; 32 -2.8,4.293
BMP180 = smd 0.6 x 0.5: 1 1.5,1.45; 2 0,1.45; 3 -1.5,1.45; 4 -1.5,-1.45; 5 0,-1.45; 6 1.5,-1.45 | smd 0.5 x 0.6: 7 1.5,0
SO14 = smd 0.6 x 2.2: 1 -3.81,-2.6; 2 -2.54,-2.6; 3 -1.27,-2.6; 4 0,-2.6; 5 1.27,-2.6; 6 2.54,-2.6; 7 3.81,-2.6; 8 3.81,2.6; 9 2.54,2.6; 10 1.27,2.6; 11 0,2.6; 12 -1.27,2.6; 13 -2.54,2.6; 14 -3.81,2.6
BU-SMA-H = drill 1.27: 1 0,0 | drill 1.778: 2 -2.55,2.55; 3 2.55,2.55; 4 2.55,-2.55; 5 -2.55,-2.55
RESONATOR-SMD = smd 0.7 x 1.7: 1 -1.2,0; 2 0,0; 3 1.2,0

### Placement (x,y rotation side)
ANT1  74.93,29.84 0 top
C1  15.24,21.59 0 top
C2  35.88,18.41 0 top
C3  42.55,20.64 180 top
C4  29.84,23.5 270 top
C5  45.09,25.4 270 top
C6  47.62,30.48 0 top
C7  37.15,33.97 90 top
C8  47.31,43.5 90 top
C9  47.62,33.34 180 top
C10  46.04,11.75 180 top
C11  53.02,11.75 180 top
C12  32.38,71.44 0 top
C13  20,8.89 270 top
C14  24.77,5.71 90 top
C15  42.55,18.41 0 top
C16  15.88,36.51 90 top
C17  29.53,67.31 270 top
C18  65.09,58.74 90 top
C19  38.73,8.26 90 top
C20  60.64,24.77 0 top
C21  33.66,5.71 90 top
C22  15.56,70.17 270 top
C23  54.93,60.01 90 top
C24  47.62,36.2 0 top
D1  20.32,44.45 180 top
D2  43.81,3.81 180 top
J1  64.45,5.08 90 top
J2  63.82,65.41 180 top
L1  57.47,59.69 90 top
L2  60.01,59.69 90 top
L3  62.55,59.69 90 top
L4  67.63,59.69 90 top
L5  70.17,59.69 90 top
L6  24.77,71.44 0 top
L7  24.77,69.22 0 top
L8  24.77,66.99 0 top
LED1  2.86,70.17 0 top
LED2  6.67,70.17 0 top
Q1  17.78,40.96 270 top
Q2  47.62,39.37 0 top
Q3  66.04,40.32 180 top
R1  12.38,39.05 0 top
R2  10.79,21.59 0 top
R3  12.38,41.91 0 top
R4  32.38,19.37 270 top
R5  2.86,64.77 90 top
R6  55.88,54.61 0 top
R7  32.38,23.5 90 top
R8  32.38,27.62 90 top
R9  47.62,22.23 90 top
R10  47.62,26.67 90 top
R11  6.67,64.77 90 top
R12  43.5,38.42 270 top
R13  43.5,43.5 90 top
R14  40.01,38.42 270 top
R15  40.01,33.97 270 top
R16  45.4,6.67 180 top
R17  46.04,9.21 0 top
R18  31.75,67.31 90 top
R19  55.88,52.07 0 top
R20  57.15,35.24 90 top
R21  57.15,30.8 270 top
R22  66.04,43.81 0 top
R23  64.77,24.77 180 top
R24  40.01,43.5 90 top
S1  22.23,17.14 180 top
SG1  30.8,40.01 0 top
SH11  1.27,0 0 top
SV1  24.45,31.43 90 top
U3  66.36,32.07 180 top
U4  12.38,8.57 180 top
U5  27.62,54.29 180 top
U6  41.59,9.21 180 top
U7  15.88,28.89 270 top
U8  11.11,66.99 180 top
U9  39.05,26.35 0 top
X1  41.59,70.17 90 top
Y1  12.38,35.56 180 top

### Tracks (layer width: path | path; a pad name or v marks a point on that pad's centre or on a via)
+3V3  (via drill 0.6)
  Top 0.406: 33.66,8.26 C21.+ 33.81,8.26 34.29,8.26 36.51,6.03 v41.59,6.03 42.54,6.98 U6.5 | U8.2 U8.3 13.15,65.54 13.65,66.04 13.65,71.12 | R19.2 R6.2 v58.1,54.61 | v63.5,31.11 63.4,31.02 U3.6_V_BCKP U3.7_VCC_IO U3.8_VCC 59.93,28.82 59.69,28.57 59.69,26.67 | v64.45,22.86 60.33,22.86 59.79,23.39 C20.1 59.69,24.87 59.69,26.67 | 13.65,71.12 v13.65,73.03 | C22.1 13.76,71.02 13.65,71.12 | v67.94,31.11 67.94,40.47 Q3.G 66.99,41.91 66.99,43.71 R22.2 66.99,43.92 66.99,46.67 66.36,47.31 v58.1,47.31 | SH11.3.3V v55.56,26.67 | v58.1,26.67 59.69,26.67
  Bottom 0.406: v63.5,31.11 v67.94,31.11 | v58.1,47.31 v58.1,54.61 58.1,58.1 55.56,60.64 35.24,60.64 34.61,61.28 34.61,69.85 31.43,73.03 v13.65,73.03 | v64.45,22.86 64.45,16.51 59.05,11.11 52.7,11.11 47.62,6.03 v41.59,6.03 | v58.1,26.67 v55.56,26.67
+5V  (via drill 0.6)
  Top 0.305: U7.4 16.27,35.43 C16.1
  Top 0.406: U6.1 42.55,11.43 42.23,11.75 40.96,11.75 40.64,11.43 U6.3 40.61,10.51 40.32,10.79 25.08,10.79 24.77,11.11 | U4.2 12.38,19.68 11.64,20.42 R2.2 11.75,21.69 11.75,22.86 12.06,23.18 13.65,23.18 13.88,23.4 U7.18 13.88,25.62 15.24,26.99 15.24,30.16 16.27,31.2 16.27,31.75 | v67.63,55.88 67.31,55.56 67.31,55.66 | U9.4 39.05,22.23 38.42,21.59 38.42,19.05 39.05,18.41 v39.69,18.41 C15.1 | R23.2 v63.82,26.35 | C17.1 29,68.16 v27.94,69.22 | U7.4 16.27,31.75 | U7.6 14.68,32 14.92,31.75 16.27,31.75 | R24.1 40.01,40.01 | 40.01,40.01 R14.1 | D1.C 22.23,44.45 23.5,43.18 v29.53,43.18 30.8,43.18 33.97,40.01 SG1.+ 40.01,40.01 | C18.1 67.63,57.89 L4.1
  Top 1.016: U4.2 12.38,13.65 13.34,12.7 20,12.7 | 20,12.7 v21.59,12.7 | v21.59,12.7 21.78,12.7 | C13.1 20,12.7 | L7.2 v27.94,69.22 | C14.+ 24.77,11.11 24.77,11.43 23.5,12.7 v21.59,12.7 | v67.63,55.88 L4.1
  Bottom 0.406: v39.69,18.41 29.53,18.41 | v63.82,26.35 62.23,26.35 | SH11.5V 53.34,29.21 54.29,28.26 54.29,13.34
  Bottom 1.016: v67.63,55.88 62.23,50.8 62.23,26.35 62.23,17.14 58.42,13.34 54.29,13.34 52.07,13.34 48.9,10.16 31.11,10.16 29.53,11.43 29.53,12.7 | v27.94,69.22 27.94,44.77 v29.53,43.18 29.53,18.41 29.53,12.7 | 29.53,12.7 v21.59,12.7
ADC2  (via drill 0.6)
  Top 0.406: v31.11,32.38 30.48,32.38 29.84,31.75 29.84,28.57 26.04,24.77 22.86,24.77 21.53,26.09 U7.25
  Bottom 0.406: SH11.A2 52.07,46.67 37.78,32.38 v31.11,32.38
ADC3  (via drill 0.6)
  Top 0.406: U7.26 21.68,26.89 22.86,25.72 26.04,25.72 28.89,28.57 28.89,31.75 30.8,33.66 v32.7,33.66
  Bottom 0.406: v32.7,33.66 38.1,33.66 50.48,46.04 50.48,47.94 SH11.A3
ANA-RX-AUD  (via drill 0.6)
  Top 0.406: U7.23 17.88,26.26 v17.78,26.35 | C9.2 44.03,33.34 v42.55,34.82 R15.1 R14.2 39.9,37.47 39.05,37.47 37.78,38.73 36.51,38.73 35.24,37.47 30.16,37.47 v27.3,34.61
  Bottom 0.406: v17.78,26.35 17.78,23.81 20.64,20.95 26.35,20.95 27.3,21.91 v27.3,34.61 | 42.76,34.61 v42.55,34.82 42.55,34.92 49.53,41.91 SH11.A0
AUD-ANNUNC
  Top 0.406: R3.1 6.35,41.91 | 6.35,41.91 SH11.D5 | U7.9 10.85,31.69 6.35,36.2 6.35,41.91
BATT-SENSE  (via drill 0.6)
  Top 0.406: C10.1 R17.2 46.89,7.3 R16.1 | 46.99,11.85 C10.1 | U7.24 18.68,23.75 17.78,22.86 17.78,15.24 19.05,13.97 27.3,13.97 28.57,12.7 38.1,12.7 38.73,13.34 46.99,13.34 | v48.9,13.34 46.99,13.34 | C10.1 46.89,13.23 46.99,13.34
  Bottom 0.406: SH11.A1 52.39,44.45 53.66,43.18 53.66,40.96 53.02,40.32 51.12,40.32 49.53,38.73 49.53,13.97 v48.9,13.34
D4  (via drill 0.6)
  Top 0.406: U7.2 17.88,35.34 v18.1,35.56
  Bottom 0.406: SH11.D4 10.48,44.45 18.1,36.83 v18.1,35.56
D6
  Top 0.406: SH11.D6 5.4,37.78 5.4,36.2 10.7,30.89 U7.10
DIG-PTT  (via drill 0.6)
  Top 0.406: U7.32 20.17,35.71 19.68,36.2 19.68,36.83 20.95,38.1 v24.13,38.1 | L8.2 26.41,63.24 v25.72,62.55 | R11.1 8.79,63.92 v8.89,63.82 | R12.1 43.5,39.37 v41.59,41.27 | v25.72,44.77 31.11,44.77 34.61,41.27 v38.42,41.27
  Bottom 0.406: v8.89,63.82 10.16,62.55 v25.72,62.55 v25.72,44.77 24.13,43.18 v24.13,38.1 | v41.59,41.27 v38.42,41.27
GND  (via drill 0.6)
  Top 0.406: C10.2 R17.1 45.09,9.11 41.59,9.11 | C19.2 41.59,9.11 | U6.2 41.59,9.11 | U7.21 16.27,21.77 C1.2 | Q1.E 15.87,40.01
  Top 1.016: C21.- 25.37,3.02
  other vias: 6.67,61.28 35.24,73.34 47.94,73.34 47.94,68.26 47.94,62.55 11.11,73.66 4.76,72.07 29.84,61.28 14.61,61.28 23.81,61.28 6.67,53.34 6.67,46.35 14.61,46.35 29.84,46.35 23.81,46.35 23.81,53.34 13.34,27.3 35.88,42.86 35.88,53.34 37.78,57.15 48.26,57.15 31.75,39.37 44.77,53.34 29.84,53.34 32.38,30.48 44.77,49.85 44.77,46.35 63.82,55.24 66.99,49.21 55.24,62.55 60.64,73.34 70.8,73.34 60.96,55.24 63.82,45.72 57.78,45.09 57.78,38.42 55.56,33.02 64.77,33.02 70.8,26.04 70.8,18.1 70.8,7.94 58.1,21.91 55.56,21.91 58.74,33.02 68.26,29.21 64.77,29.21 70.17,1.91 58.74,1.91 39.37,1.91 29.21,1.91 19.68,1.91 3.81,12.06 19.68,6.03 29.21,6.03 22.23,10.48 12.38,37.15 16.83,29.84 58.74,7.94 33.66,16.19 24.77,17.14 16.51,14.61 6.67,19.68 6.67,14.61 44.77,14.61 46.99,18.73 42.55,32.7 55.56,49.85 8.89,39.37 6.35,32.38 25.08,36.51 64.77,37.15 35.88,46.35 41.91,26.35 19.37,20.64 16.51,18.41 13.97,19.68 66.04,18.1 34.61,21.27 39.37,12.06 29.84,69.85 38.42,42.86
  pour Bottom (isolate 0.254): 0.32,1.59 1.59,0.32 71.44,0.32 72.71,1.59 72.71,73.66 71.44,74.93 47.31,74.93 47.31,61.59 35.88,61.59 35.88,74.93 1.59,74.93 0.32,73.66
  pour Top (isolate 0.254): 72.71,73.66 71.44,74.93 47.31,74.93 47.31,61.59 35.88,61.59 35.88,74.93 1.59,74.93 0.32,73.66 0.32,1.59 1.59,0.32 71.44,0.32 72.71,1.59
GPS-RX  (via drill 0.6)
  Top 0.254: 66.04,24.13 R23.1
  Top 0.406: SH11.D8 7.54,29.29 U7.12 12.94,29.29 v13.34,28.89 | Q3.D 66.04,24.13 66.04,22.54 63.82,20.32 59.05,20.32 54.61,15.88 40.32,15.88 38.1,13.65 28.57,13.65 26.67,15.56 26.67,20 26.04,20.64 23.81,20.64 v20.95,23.5
  Bottom 0.406: v20.95,23.5 20.32,24.13 20.32,30.48 19.05,31.75 16.19,31.75 v13.34,28.89
GPS-TX  (via drill 0.6)
  Top 0.406: SH11.D7 10.55,30.09 U7.11 12.95,30.09 v13.34,30.48 | R21.2 56.83,29.63 56.83,19.05 54.61,16.83 40.32,16.83 38.1,14.61 28.57,14.61 27.62,15.56 27.62,20 26.04,21.59 25.08,21.59 v23.18,23.5
  Bottom 0.406: v23.18,23.5 21.27,25.4 21.27,30.48 19.05,32.7 15.56,32.7 v13.34,30.48
MISO
  Top 0.406: U7.16 7.04,26.09 SH11.D12
MOSI
  Top 0.406: U7.15 5.3,26.89 SH11.D11
N$1
  Top 0.406: R4.2 34.92,18.52 C2.1 35.24,18.63 35.24,19.68 37.78,22.23 U9.3
N$2
  Top 0.406: U9.2 U9.1 34.87,23.75 33.66,22.54 32.49,22.54 R7.1 32.55,22.64
N$3  (via drill 0.6)
  Top 0.406: R8.1 32.38,26.04 | 32.38,26.04 R7.2 | C3.2 v39.69,20.64 | v34.29,26.04 32.38,26.04
  Bottom 0.406: v39.69,20.64 v34.29,26.04
N$4
  Top 0.406: C4.1 29.84,26.35 31.75,28.26 32.17,28.26 R8.2 32.49,28.57 33.34,28.57 36.2,25.72 39.69,25.72 40.32,25.08 U9.5
N$5
  Top 0.406: 43.5,21.27 43.5,21.91 42.86,22.54 U9.7 U9.6 | 43.5,21.27 43.5,20.74 C3.1 | R9.1 43.6,21.38 43.5,21.27
N$6
  Top 0.406: R10.1 47.62,24.77 | 47.62,24.77 R9.2 | C5.2 47.41,24.55 47.62,24.77
N$7
  Top 0.406: U9.10 40.32,30.16 40.96,30.8 47.09,30.8 C6.1 46.67,30.38 46.67,29.21 47.41,28.47 47.41,27.73 R10.2
N$8
  Top 1.016: D2.A 47.62,3.81 49.85,1.59 55.26,1.59 J1.VIN0
N$9
  Top 0.406: SG1.- 26.59,40.96 Q1.C 18.88,44.19 D1.A
N$10
  Top 0.406: L6.2 C12.1 31.54,68.38 R18.2
N$11  (via drill 0.6)
  Top 0.406: C5.1 v45.09,29.21 44.83,28.95 U9.8 U9.9 | v38.42,31.43 37.15,32.7 C7.1
  Bottom 0.406: v45.09,29.21 40.64,29.21 v38.42,31.43
N$12
  Bottom 0.61: X1.1 U5.RFOUT
N$13  (via drill 0.6)
  Top 0.406: U7.1 18.68,30.74 v18.41,30.48 | v26.04,22.86 28.57,20.32 32.28,20.32 R4.1
  Bottom 0.406: v18.41,30.48 19.37,29.53 19.37,23.18 20.64,21.91 25.08,21.91 v26.04,22.86
N$14
  Top 0.406: R22.1 65.09,43.72 Q3.S 64.94,41.27 64.14,41.27 63.5,40.64 63.5,35.88 63.04,35.42 U3.2_TXD1
N$15
  Top 0.406: R21.1 R20.1 57.23,34.32 U3.3_RXD1
N$16
  Top 0.406: U3.11_RF_IN 75.4,28.82 ANT1.FEED
N$17
  Top 0.406: U7.8 12.22,33.19 11.11,34.29 11.11,35.49 Y1.3 11.18,38.7 R1.1
N$20
  Top 0.406: C24.1 46.77,38.17 Q2.B 46.51,38.1 45.72,38.1 45.19,37.57 R12.2
N$23
  Top 0.406: LED2.A R11.2
N$25
  Top 0.406: LED1.A R5.2
N$27
  Top 0.406: R3.2 Q1.B
N$41
  Top 0.406: L6.1 22.23,71.44 16.19,65.41 U5.TXD
N$42
  Top 1.016: U5.VCC 21.27,68.58 21.91,69.22 L7.1
N$43
  Top 0.406: U5.EN 23.81,65.41 23.18,66.04 23.18,66.93 L8.1
N$45
  Top 0.406: L1.2 J2.1
N$46
  Top 0.406: L2.2 J2.2
N$47
  Top 0.406: L3.2 J2.3
N$49
  Top 0.406: L4.2 J2.5
N$50
  Top 0.406: L5.2 J2.6
N$59
  Top 0.406: U7.20 15.47,23.73 14.61,22.86 14.61,21.8 C1.1
N$60
  Top 0.406: U6.4 40.61,7.91 40.01,7.3 38.84,7.3 C19.1
N$64
  Top 0.406: U7.7 13.88,35.27 Y1.1 13.58,38.7 R1.2
PTT  (via drill 0.6)
  Top 0.406: L2.1 60.01,57.78 58.74,56.52 v55.88,56.52 | Q2.C 47.62,42.33 C8.1 R13.1 43.28,42.86 v41.59,42.86
  Bottom 0.406: v55.88,56.52 55.56,56.2 51.12,56.2 47.62,52.7 47.62,46.04 44.13,42.55 41.91,42.55 v41.59,42.86
RESET  (via drill 0.6)
  Top 0.406: S1.3 S1.4 v19.68,17.46 | U7.29 18.97,29.29 v18.1,28.57 | R2.1 9.95,22.12 v8.89,23.18
  Bottom 0.406: SH11.D10 4.13,27.94 v8.89,23.18 14.61,23.18 | v18.1,28.57 17.46,28.57 14.61,25.72 14.61,23.18 | 14.61,23.18 19.68,18.1 v19.68,17.46
RFGND
  pour Bottom: 36.83,74.3 36.83,62.87 46.35,62.87 46.35,74.3
RX-AUDIO
  Top 0.406: L3.1 62.48,58.04 62.48,54.55 55.56,47.62 55.56,40.32 54.29,39.05 50.8,39.05 49.85,38.1 49.85,34.29 48.9,33.34 C9.1
RXD
  Top 0.406: U7.30 21.98,30.09 23.18,28.89 SV1.1
  Bottom 0.406: SV1.1 23.18,28.89 22.23,29.84 22.23,37.15 21.59,37.78 19.05,37.78 5.4,51.44 5.4,53.02 SH11.RX
SCK
  Top 0.406: R5.1 2.86,61.91 1.91,60.96 1.91,20.95 2.54,20.32 SH11.D13 5.71,22.23 5.71,23.18 7.62,25.08 11.75,25.08 12.23,24.6 U7.17
SCL  (via drill 0.6)
  Top 0.406: v32.7,36.2 30.8,36.2 26.99,32.38 26.99,28.57 26.04,27.62 22.86,27.62 21.99,28.49 U7.28 | v52.07,58.42 SH11.A5 R6.1 | U8.5 v11.11,71.44
  Bottom 0.406: v32.7,36.2 38.42,36.2 44.77,42.23 48.58,46.04 48.58,51.12 SH11.A5 | v52.07,58.42 50.8,59.69 35.24,59.69 33.66,61.28 33.66,69.85 31.43,72.07 14.61,72.07 13.97,71.44 v11.11,71.44
SDA  (via drill 0.6)
  Top 0.406: v31.11,34.92 27.94,31.75 27.94,28.57 26.04,26.67 22.86,26.67 21.84,27.69 U7.27 | v50.48,58.42 50.48,53.66 SH11.A4 R19.1 | U8.6 9.61,70.08 v9.53,70.17
  Bottom 0.406: v31.11,34.92 38.1,34.92 45.4,41.91 49.53,46.04 49.53,49.53 SH11.A4 | v9.53,70.17 13.65,70.17 14.61,71.12 31.43,71.12 32.7,69.85 32.7,61.28 35.24,58.74 50.16,58.74 v50.48,58.42
TNC-TX
  Top 0.406: U7.14 6.6,27.69 SH11.D9
TX-AUDIO  (via drill 0.6)
  Top 0.406: C7.2 v37.15,37.47 | R18.1 31.75,63.82 v30.8,62.87 | C23.1 54.71,58.84 54.71,58.26 54.93,58.04 | L1.1 54.93,58.04 | 54.93,58.04 53.91,58.04 v53.66,57.78 | R13.2 43.4,44.45 v41.59,44.45 40.11,44.45 R24.2
  Bottom 0.406: 31.11,62.55 v30.8,62.87 30.8,61.91 37.15,55.56 37.15,44.45 | v53.66,57.78 53.02,57.15 51.12,57.15 46.67,52.7 46.67,46.04 45.09,44.45 v41.59,44.45 37.15,44.45 | v37.15,37.47 37.15,44.45
TXD  (via drill 0.6)
  Top 0.406: 21.59,31.43 21.05,30.89 U7.31 | 21.59,31.43 21.59,35.88 v20.95,36.51 | SV1.2 21.59,31.43
  Bottom 0.406: v20.95,36.51 19.37,36.51 SH11.TX
V+  (via drill 0.6)
  Top 0.406: R16.2 44.52,6.67 D2.C
  Top 1.016: D2.C v39.37,3.81 | U4.3 v9.84,12.06 | v60.01,49.21 64.14,49.21 70.17,55.24 L5.1 | v55.88,8.57 55.88,11.75 | 55.88,11.75 55.88,14.61 v56.83,15.56 | C11.1 55.88,11.75
  Bottom 1.016: 60.01,36.83 60.01,18.73 v56.83,15.56 | SH11.VIN 60.01,36.83 | v9.84,12.06 18.1,3.81 v39.37,3.81 47.62,3.81 49.85,1.59 55.24,1.59 55.88,2.22 v55.88,8.57 | v60.01,49.21 60.01,36.83

### Text on the board
tNames: Status | PTT | VHF Xmit | ArduinoTrack Shield v1.11 / Custom Digital Services, LLC / www.custom-ds.com | THIS / SIDE UP | Q3 | GPS Antenna | GND / TX / RX | Reset | 6.5-14V DC